# EAGLE design dual-h-bridge (EAGLE 7.2.0)
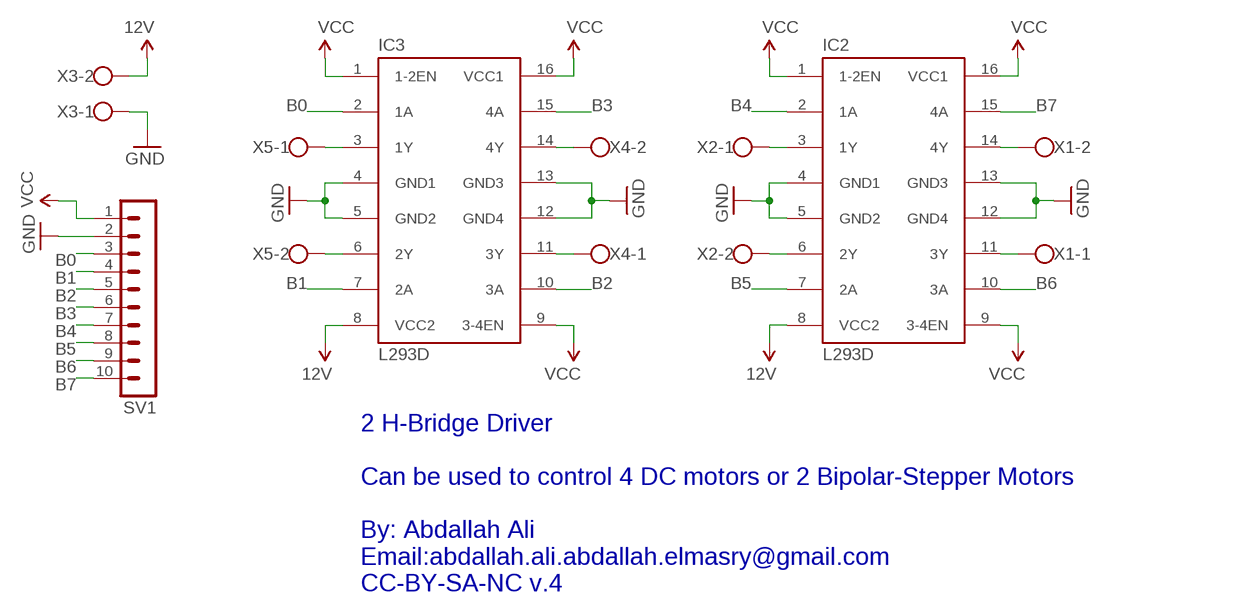
[diagram p0: schematic, sheet 1]

## Parts
IC2  L293D  [DIL16]
IC3  L293D  [DIL16]
SV1  MA10-1  [MA10-1]
X1  W237-102  [W237-102]
X2  W237-102  [W237-102]
X3  W237-102  [W237-102]
X4  W237-102  [W237-102]
X5  W237-102  [W237-102]

## Nets
12V: IC2.8(VCC2) IC3.8(VCC2) X3.2
B0: IC3.2(1A) SV1.3
B1: IC3.7(2A) SV1.4
B2: IC3.10(3A) SV1.5
B3: IC3.15(4A) SV1.6
B4: IC2.2(1A) SV1.7
B5: IC2.7(2A) SV1.8
B6: IC2.10(3A) SV1.9
B7: IC2.15(4A) SV1.10
GND: IC2.4(GND1) IC2.5(GND2) IC2.12(GND4) IC2.13(GND3) IC3.4(GND1) IC3.5(GND2) IC3.12(GND4) IC3.13(GND3) SV1.2 X3.1
N$1: IC3.3(1Y) X5.1
N$2: IC2.3(1Y) X2.1
N$3: IC2.6(2Y) X2.2
N$4: IC2.11(3Y) X1.1
N$5: IC2.14(4Y) X1.2
N$6: IC3.6(2Y) X5.2
N$7: IC3.11(3Y) X4.1
N$8: IC3.14(4Y) X4.2
VCC: IC2.1(1-2EN) IC2.9(3-4EN) IC2.16(VCC1) IC3.1(1-2EN) IC3.9(3-4EN) IC3.16(VCC1) SV1.1

## Notes on the sheet
- 2 H-Bridge Driver 
  
  Can be used to control 4 DC motors or 2 Bipolar-Stepper Motors
  
  By: Abdallah Ali
  Email:abdallah.ali.abdallah.elmasry@gmail.com
  CC-BY-SA-NC v.4

## Library data of the parts
IC2 IC3 = st-microelectronics:L293D: PUSH-PULL 4 CHANNEL DRIVER; MPN: L293D; OC_FARNELL: 9589619; OC_NEWARK: 56P8249
SV1 = con-lstb:MA10-1: PIN HEADER; OC_FARNELL: unknown; OC_NEWARK: unknown
X1-X5 = con-wago-500:W237-102: WAGO SCREW CLAMP; MPN: 237-102; OC_FARNELL: unknown; OC_NEWARK: 70K9898

## Board
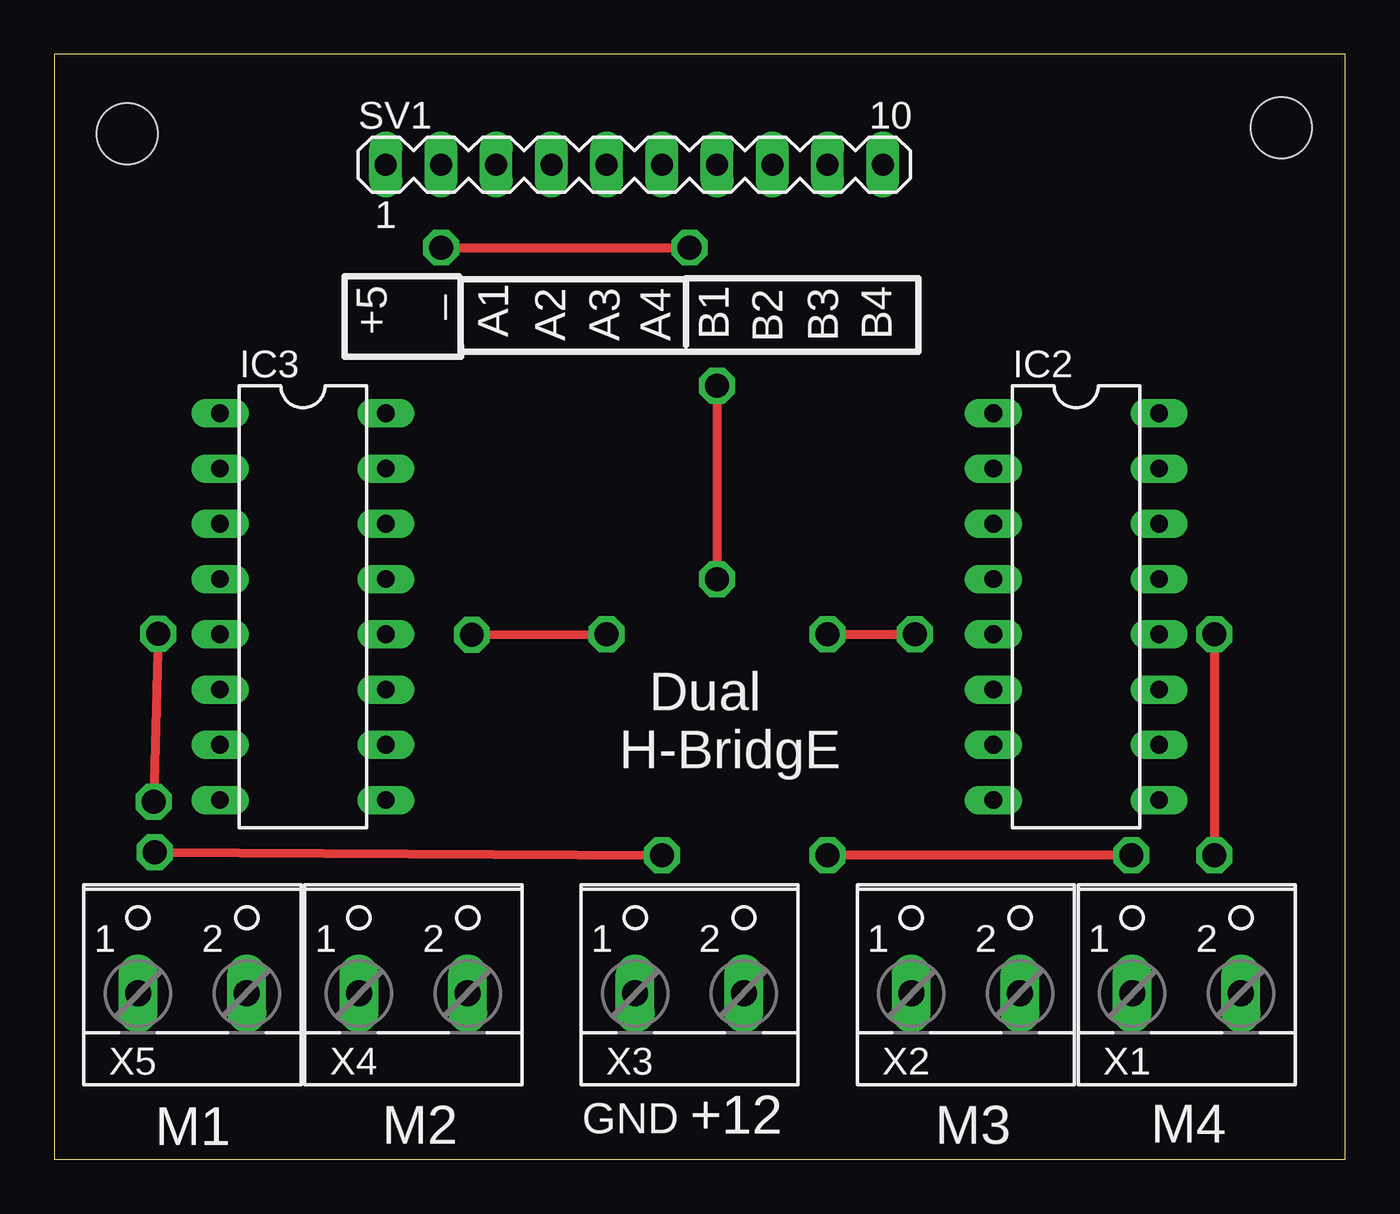
[diagram p1: board, top side]
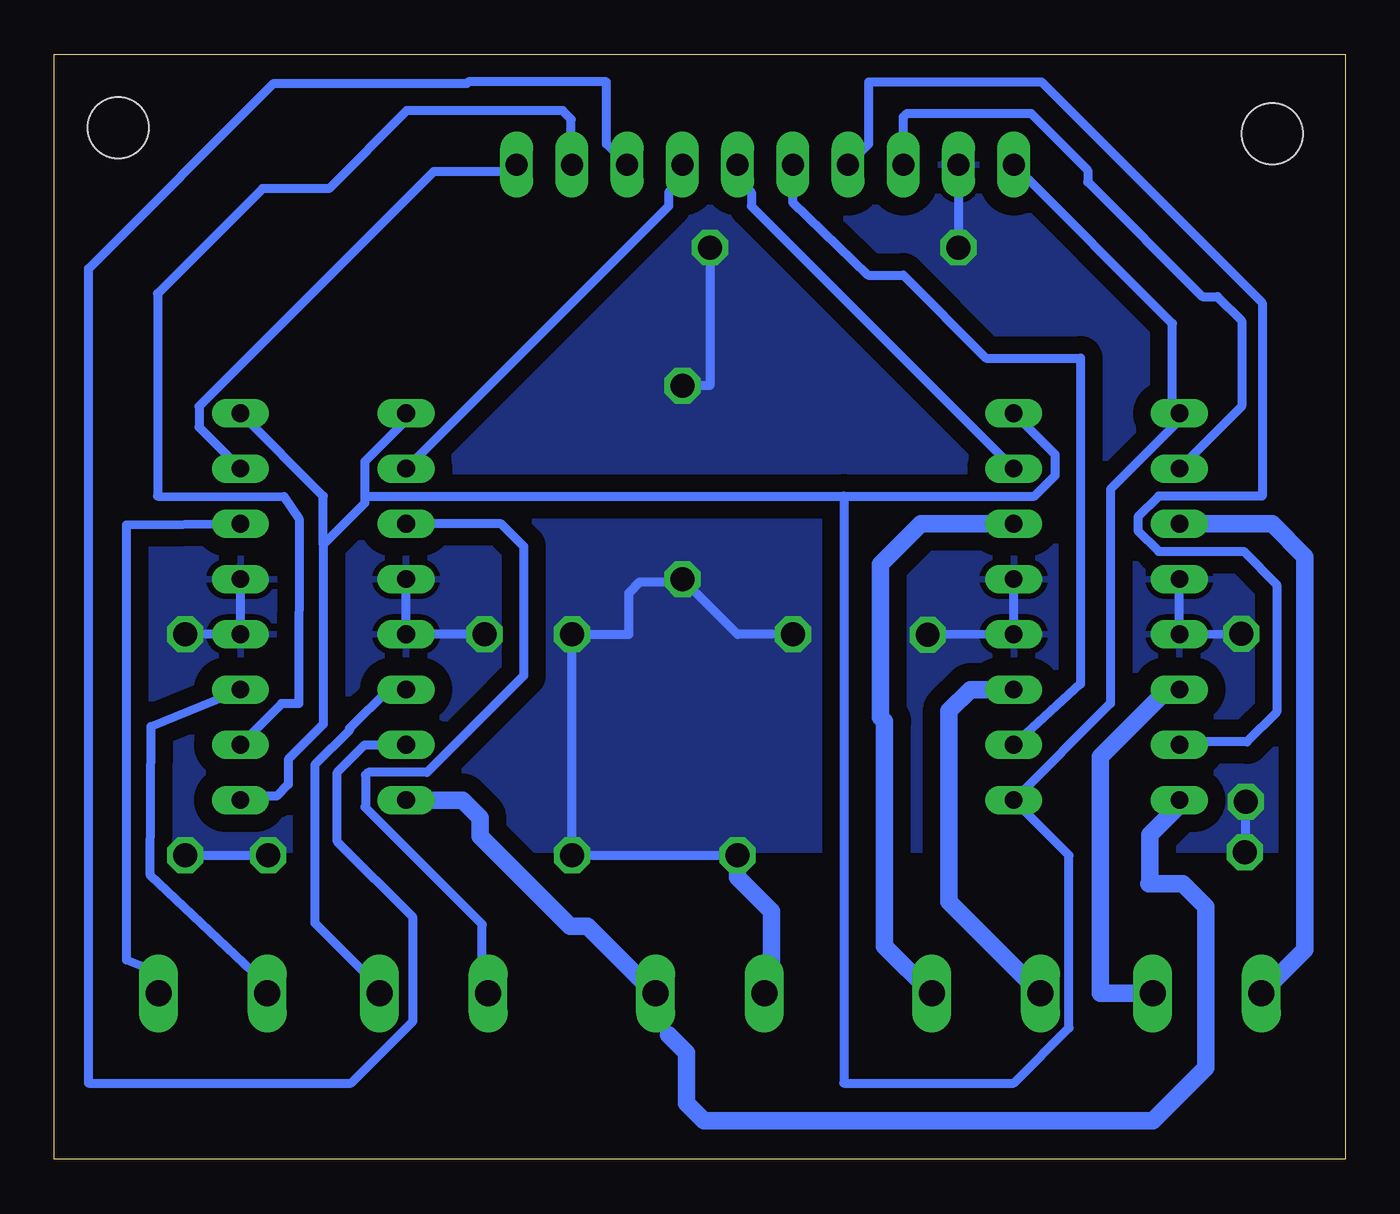
[diagram p2: board, bottom side, seen from below]

Size 59.36 x 50.79 mm. Coordinates in mm from the lower left corner, seen from the top.
Outline: 0,0 59.36,0 59.36,50.79 0,50.79 0,0
Copper layers (1*16): Top 0.035mm / dielectric 1.5mm / Bottom 0.035mm
Design rules "default *": minimum track width 16mil, minimum drill 24mil, track to track 8mil, track to pad 8mil, pad to pad 8mil, via to via 8mil, smd to smd 8mil, copper to edge 40mil, drill to drill 8mil, minimum pad ring 10mil, minimum via ring 8mil, stop-mask expansion 4mil, vias tented up to drill 0mil, thermal gap 10mil
Holes 2.8 mm at 56.42,47.42 3.36,47.14

### Footprints (pad centres in the part's own frame; a part is rotated, then mirrored left to right if it is on the bottom)
DIL16 = drill 0.813 long: 1 -8.89,-3.81; 2 -6.35,-3.81; 3 -3.81,-3.81; 4 -1.27,-3.81; 5 1.27,-3.81; 6 3.81,-3.81; 7 6.35,-3.81; 8 8.89,-3.81; 9 8.89,3.81; 10 6.35,3.81; 11 3.81,3.81; 12 1.27,3.81; 13 -1.27,3.81; 14 -3.81,3.81; 15 -6.35,3.81; 16 -8.89,3.81
MA10-1 = drill 1.016 long: 1 -11.43,0; 2 -8.89,0; 3 -6.35,0; 4 -3.81,0; 5 -1.27,0; 6 1.27,0; 7 3.81,0; 8 6.35,0; 9 8.89,0; 10 11.43,0
W237-102 = drill 1.194 long: 1 -2.5,-1.27; 2 2.5,-1.27

### Placement (x,y rotation side)
IC2  46.99,25.4 270 top
IC3  11.43,25.4 270 top
SV1  26.67,45.72 0 top
X1  52.07,8.89 0 top
X2  41.91,8.89 0 top
X3  29.21,8.89 0 top
X4  16.51,8.89 0 top
X5  6.35,8.89 0 top

### Tracks (layer width: path | path; a pad name or v marks a point on that pad's centre or on a via)
12V
  Bottom 0.406: 31.12,5.71 31.75,6.35 31.75,7.62 X3.2
  Bottom 0.813: 31.75,7.62 34.84,10.71 35.65,10.71 39.79,14.85 39.79,15.7 40.6,16.51 IC2.8 | 31.12,5.71 30.29,4.89 30.29,2.57 29.49,1.78 8.84,1.78 6.41,4.21 6.41,11.6 7.47,12.66 9.02,12.66 8.97,12.7 8.97,14.92 7.62,16.27 IC3.8
B0
  Bottom 0.406: IC3.2 4.76,34.61 4.76,38.54 5.88,39.66 6.57,39.66 11.83,44.92 11.83,45.46 14.45,48.08 20.15,48.08 20.32,47.91 SV1.3
B1
  Bottom 0.406: SV1.4 21.91,46.67 21.91,49.53 13.97,49.53 3.81,39.37 3.81,30.48 8.57,30.48 9.52,29.53 9.52,28.89 8.57,27.94 4.66,27.94 3.14,26.42 3.14,20.56 4.52,19.18 7.49,19.18 IC3.7
B2
  Bottom 0.406: IC3.10 12.17,21.85 12.17,36.83 16.51,36.83 20.32,40.64 21.94,40.64 25.41,43.99 SV1.5
B3
  Bottom 0.406: IC3.15 27.3,43.81 27.3,44.45 27.94,45.08 SV1.6
B4
  Bottom 0.406: IC2.2 31.12,43.81 31.12,44.45 30.48,45.08 SV1.7
B5
  Bottom 0.406: IC2.7 45.08,19.05 46.36,17.78 46.36,14.6 42.86,11.11 42.86,6.35 45.72,3.49 57.78,3.49 57.78,40.94 49.27,49.46 40.39,49.46 40.32,49.53 33.97,49.53 33.97,46.67 SV1.8
B6
  Bottom 0.406: SV1.9 35.56,46.04 35.59,46.07 35.59,47.81 35.99,48.2 43.15,48.2 46.73,44.62 49.78,44.62 54.61,39.8 54.61,30.48 48.8,30.45 48.11,29.45 48.12,20.94 48.91,20.94 IC2.10
B7
  Bottom 0.406: IC2.15 52.7,33.66 52.7,34.61 41.91,45.4 38.1,45.4 SV1.10
GND  (via drill 1.1)
  Top 0.406: v17.78,41.91 v29.21,41.91 | v30.48,35.56 v30.48,26.67 | v35.56,24.13 v39.57,24.13 | v53.34,24.13 v53.34,13.97 | v49.53,13.97 v35.56,13.97 | v4.77,24.16 v4.57,16.42 | v4.61,14.1 v27.94,13.97 | v19.2,24.11 v25.4,24.13
  Bottom 0.406: SV1.2 v17.78,41.91 | v29.21,41.91 29.21,35.56 v30.48,35.56 | v39.57,24.13 IC2.5 IC2.4 | v53.34,24.13 IC2.12 IC2.13 | v53.34,13.97 v49.53,13.97 | v4.77,24.16 IC3.5 IC3.4 | v4.57,16.42 v4.61,14.1 | v19.2,24.11 IC3.12 IC3.13 | v25.4,24.13 27.94,24.13 v30.48,26.67 30.61,26.54 32.43,26.54 32.94,26.03 32.94,24.13 v35.56,24.13 v35.56,13.97 v27.94,13.97
  Bottom 0.813: X3.1 26.38,7.95 26.38,11.4 27.94,12.96 v27.94,13.97
  pour Bottom (isolate 0.813): 58.78,49.76 58.78,14.23 1.11,14.23 1.11,49.78 1.14,49.78 1.16,49.81
N$1
  Bottom 0.813: IC3.3 3.36,29.21 1.85,27.7 1.85,9.62 X5.1
N$2
  Bottom 0.406: IC2.3 38.81,29.21 37.77,28.18 37.77,22.23 42.23,17.78 44.93,17.78 45.05,17.65 45.05,16.22 45.09,16.19 39.69,10.79 39.69,7.62 X2.1
N$3
  Bottom 0.406: X2.2 44.45,7.62 44.45,7.94 47.38,10.87 47.38,18.13 45.78,19.73 45.78,19.8 43.99,21.59 IC2.6
N$4
  Bottom 0.406: IC2.11 54.92,19.9 54.95,13.05 49.85,8.25 49.85,7.62 X1.1
N$5
  Bottom 0.406: IC2.14 56.04,29.16 56.04,9.15 54.61,8.57 54.61,7.62 X1.2
N$6
  Bottom 0.406: 8.89,7.94 8.89,7.62 X5.2
  Bottom 0.813: IC3.6 8.18,21.59 11.27,18.5 11.27,7.62 X5.2
N$7
  Bottom 0.406: 14.29,7.62 X4.1
  Bottom 0.813: IC3.11 17.23,21.59 18.22,20.61 18.22,11.83 X4.1
N$8
  Bottom 0.406: 19.05,7.62 X4.2
  Bottom 0.813: X4.2 21.19,9.8 21.19,20.13 21.38,20.32 21.38,27.35 19.52,29.21 IC3.14
VCC
  Bottom 0.406: 7.94,33.66 7.62,33.97 IC3.1 7.94,33.66 | 7.94,33.66 10.79,30.8 10.79,20.95 IC3.9 12.7,13.97 12.7,6.03 15.24,3.49 23.05,3.49 23.05,30.48 | SV1.1 7.94,38.42 7.94,33.66 | IC3.16 13.33,32.38 13.33,31.43 14.29,30.48 23.05,30.48 | 45.09,30.48 23.05,30.48 | 45.09,30.48 45.09,32.07 43.18,33.97 IC2.1 | 46.99,28.26 46.99,20 48.61,18.38 48.61,17.23 49.14,16.69 50.62,16.69 IC2.9 | 46.99,28.26 45.09,30.16 45.09,30.48 | IC2.16 46.99,30.48 46.99,28.26

### Text on the board
tNames: _ | +5 | A1 | A2 | A3 | A4 | B1 | B2 | B3 | B4 | Dual / H-BridgE | +12 | M1 | M2 | GND | M3 | M4